# Altium project STM32F4Dash.PrjPcb
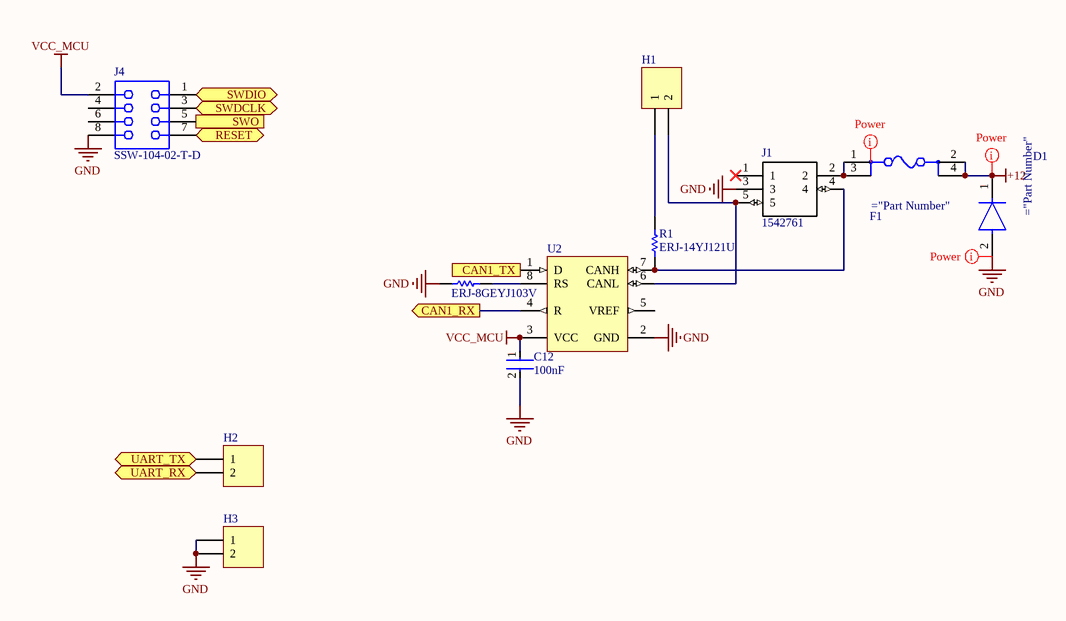
[diagram p0: Communications.SchDoc]
5 sheets, 42 parts. Net scope: flat (ports and power ports of the same name join across sheets).
Board file: STM32F4Dash.PcbDoc
Sheets:
  Communications.SchDoc
  MCU.SchDoc
  IO.SchDoc
  Power_Supply.SchDoc
  User_LEDs.SchDoc

## Sheet Communications.SchDoc
size A; Organization: Altium Limited; Address1: L3, 12a Rodborough Rd; Address2: Frenchs Forest; Address3: NSW; Address4: Australia 2086

### Parts
C12  100nF  [Kemet_C0603_IPC_A]
D1  S1J-13-F  [Diodes_SMA_0]  (value not drawn)
F1  3557-2  [Keystone_3557-2_0]  (value not drawn)
H1  Header 0  [HDR1X2]  (value not drawn)
H2  Header 0  [HDR1X2]  (value not drawn)
H3  Header 0  [HDR1X2]  (value not drawn)
J1  1542761  [1542761]
J4  SSW-104-02-T-D  [SMTC-SSW-104-02-X-D]
R1  ERJ-14YJ121U  [RESC3225X70X50ML20T20]
R9  ERJ-8GEYJ103V  [RESC3216X70X50NL05T20]
U2  SN65HVD230D  [D0008A_M]  (value not drawn)

### Ports
CAN1_RX (out), CAN1_TX (in), RESET (bidir), SWDCLK (bidir), SWDIO (bidir), SWO (out), UART_RX (bidir), UART_TX (bidir)

### Nets
+12: D1.1(C) F1.2 F1.4
GND: C12.2 D1.2(A) H3.1 H3.2 J1.3 J4.8 R9.2 U2.2(GND)
VCC_MCU: C12.1 J4.2 U2.3(VCC)
NetC3_1: J4.7 ; port RESET
NetF1_1: F1.1 F1.3 J1.2
NetH1_1: H1.1 R1.2
NetH1_2: H1.2 J1.5 U2.6(CANL)
NetH2_1: H2.1 ; port UART_TX
NetH2_2: H2.2 ; port UART_RX
NetJ1_4: J1.4 R1.1 U2.7(CANH)
NetJ4_1: J4.1 ; port SWDIO
NetJ4_3: J4.3 ; port SWDCLK
NetJ4_5: J4.5 ; port SWO
NetR9_1: R9.1 U2.8(RS)
NetU1_95: U2.4(R) ; port CAN1_RX
NetU1_96: U2.1(D) ; port CAN1_TX

Not connected (* = marked no-connect by the designer): J1 1*; J4 4 6; U2 5(VREF)

### Layout directives
net class Power: (no net found under the mark), +12, GND

### Notes on the sheet
- Title
- Size:
- Date:
- A
- Number:
- Time:
- Revision:
- Sheet
- of
- File:

### Library data of the parts
C12 = C0603C104K5RACTU: CAP CER 0.1UF 100NF 50V X7R 0603 C0603C104K5RACTU
H1-H3 = Header 2: Header, 2-Pin; LatestRevisionDate: 17-Jul-2002; LatestRevisionNote: Re-released for DXP Platform.; Publisher: Altium Limited
J1 = 1542761: Connector; Manufacturer_Name: Phoenix Contact; Allied_Number: 70170366; Datasheet Link: https://media.digikey.com/PDF/Data%20Sheets/Phoenix%20Contact%20PDFs/1542761.pdf; Height: 18mm; Manufacturer_Part_Number: 1542761; Mouser Part Number: 651-1542761; Mouser Price/Stock: https://www.mouser.com/Search/Refine.aspx?Keyword=651-1542761; RS Part Number: 8025583; RS Price/Stock: http://uk.rs-online.com/web/p/products/8025583; Allied Price/Stock: https://www.alliedelec.com/phoenixcontact-1542761/70170366/
J4 = CMP-1023-00342-1: SQ Post Socket, Through-hole, Vertical, -55 to 105 degC, 2.54mm Pitch, 8-Pin, Female, RoHS; Manufacturer: Samtec; Mounting Technology: Through-hole; ComponentLink3Description: Package Specification; ComponentLink3URL: http://www.samtec.com/documents/webfiles/cpdf/SSW-1XX-XX-XXX-X-XX-XXX-XX-MKT.pdf; Temperature Range: -55 to 105 degC; DatasheetVersion: F-214; PackageVersion: CA, 6/1987; ComponentLink1URL: http://www.samtec.com; RoHS: True; Pitch: 2.54 mm; ComponentLink2Description: Datasheet; ComponentLink2URL: http://www.samtec.com/documents/webfiles/pdf/SSW_TH.PDF; PackageDescription: Assembly, Socket Strip .016 X .031 Tail; PackageReference: SSW-104-02-X-D; ComponentLink1Description: Manufacturer URL; PartNumber: SSW-104-02-T-D; Orientation: Vertical
R1 = CMP-2005-03490-1: 120Ohm; Manufacturer: Panasonic; Part Number: ERJ-14YJ121U
R9 = CMP-2003-00545-1: 10k; Manufacturer: Panasonic; Part Number: ERJ-8GEYJ103V
U2 = CMP-0315-00046-3: CAN Bus Transceiver, 3.3 V, -40 to 85 degC, 8-Pin SOIC (D), Green (RoHS & no Sb/Br), Tube; Supply Voltage Min: 3 V; Supply Voltage Max: 3.6 V; PartNumber: SN65HVD230D; ComponentLink2URL: http://www.ti.com/general/docs/lit/getliterature.tsp?genericGeneric Part Number=SN65HVD230&fileType=pdf; DatasheetVersion: SLOS346N; Generic Part Number: SN65HVD230; Packing: Tube; Temperature Min: -40 degC; Temperature Max: 85 degC; ComponentLink1Description: Manufacturer URL; Mounting Technology: Surface Mount; RoHS: TRUE; ComponentLink1URL: http://www.ti.com/; ComponentLink2Description: Datasheet; PackageDescription: 8-Pin Plastic Small Outline, Body 4.9 x 3.9 mm, Pitch 1.27 mm

## Sheet MCU.SchDoc
size A4; Organization: Altium Limited; Address1: L3, 12a Rodborough Rd; Address2: Frenchs Forest; Address3: NSW; Address4: Australia 2086
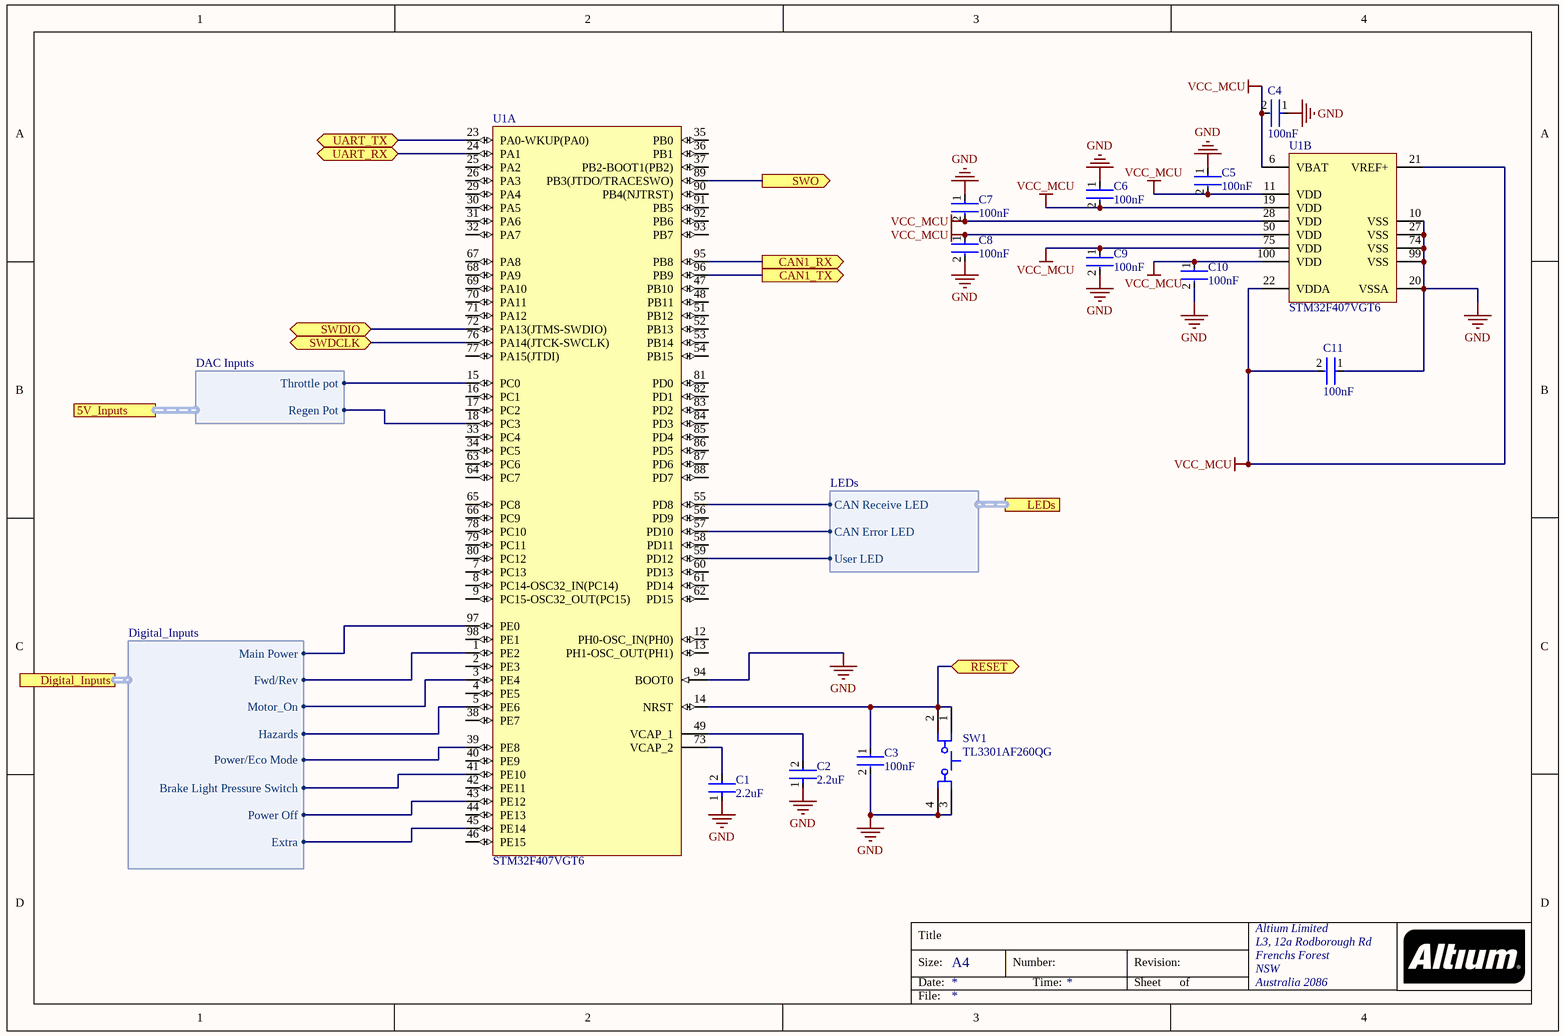
[diagram p1: MCU.SchDoc]

### Parts
C1  2.2uF  [Yageo_CC0805-0.85_IPC_A]
C2  2.2uF  [Yageo_CC0805-0.85_IPC_A]
C3  100nF  [Kemet_C0603_IPC_A]
C4  100nF  [Kemet_C0603_IPC_A]
C5  100nF  [Kemet_C0603_IPC_A]
C6  100nF  [Kemet_C0603_IPC_A]
C7  100nF  [Kemet_C0603_IPC_A]
C8  100nF  [Kemet_C0603_IPC_A]
C9  100nF  [Kemet_C0603_IPC_A]
C10  100nF  [Kemet_C0603_IPC_A]
C11  100nF  [Kemet_C0603_IPC_A]
SW1  TL3301AF260QG  [ESWI-TL3301AF260QG_V]
U1  STM32F407VGT6  [STM-LQFP100_M]  (parts A,B of 2)

### Ports
5V_Inputs (harness DAC Inputs), CAN1_RX (out), CAN1_TX (out), Digital_Inputs (harness Digital_Inputs), LEDs (harness LEDs), RESET (bidir), SWDCLK (bidir), SWDIO (bidir), SWO (out), UART_RX (bidir), UART_TX (bidir)

### Harnesses
DAC Inputs: Throttle pot, Regen Pot
LEDs: CAN Error LED, CAN Receive LED, User LED
Digital_Inputs: Main Power, Fwd/Rev, Motor_On, Hazards, Power/Eco Mode, Brake Light Pressure Switch, Power Off, Extra

### Nets
GND: C1.1 C2.1 C3.2 C4.1 C5.1 C6.1 C7.1 C8.2 C9.2 C10.2 C11.1 SW1.3 SW1.4 U1.10(VSS) U1.20(VSSA) U1.27(VSS) U1.74(VSS) U1.94(BOOT0) U1.99(VSS)
VCC_MCU: C4.2 C5.2 C6.2 C7.2 C8.1 C9.1 C10.1 C11.2 U1.6(VBAT) U1.11(VDD) U1.19(VDD) U1.21(VREF+) U1.22(VDDA) U1.28(VDD) U1.50(VDD) U1.75(VDD) U1.100(VDD)
NetC1_2: C1.2 U1.73(VCAP_2)
NetC2_2: C2.2 U1.49(VCAP_1)
NetC3_1: C3.1 SW1.1 SW1.2 U1.14(NRST) ; port RESET
NetH2_1: U1.23(PA0-WKUP(PA0)) ; port UART_TX
NetH2_2: U1.24(PA1) ; port UART_RX
NetJ2_1: U1.45(PE14) ; port Digital_Inputs.Extra
NetJ2_2: U1.43(PE12) ; port Digital_Inputs.Power Off
NetJ2_3: U1.41(PE10) ; port Digital_Inputs.Brake Light Pressure Switch
NetJ2_4: U1.39(PE8) ; port Digital_Inputs.Power/Eco Mode
NetJ2_5: U1.97(PE0) ; port Digital_Inputs.Main Power
NetJ2_6: U1.1(PE2) ; port Digital_Inputs.Fwd/Rev
NetJ2_7: U1.3(PE4) ; port Digital_Inputs.Motor_On
NetJ2_8: U1.5(PE6) ; port Digital_Inputs.Hazards
NetJ3_2: U1.18(PC3) ; port 5V_Inputs.Regen Pot
NetJ4_1: U1.72(PA13(JTMS-SWDIO)) ; port SWDIO
NetJ4_3: U1.76(PA14(JTCK-SWCLK)) ; port SWDCLK
NetJ4_5: U1.89(PB3(JTDO/TRACESWO)) ; port SWO
NetR2_2: U1.15(PC0) ; port 5V_Inputs.Throttle pot
NetR6_2: U1.55(PD8) ; port LEDs.CAN Receive LED
NetR7_2: U1.57(PD10) ; port LEDs.CAN Error LED
NetR8_2: U1.59(PD12) ; port LEDs.User LED
NetU1_95: U1.95(PB8) ; port CAN1_RX
NetU1_96: U1.96(PB9) ; port CAN1_TX

Not connected (* = marked no-connect by the designer): U1 2(PE3) 4(PE5) 7(PC13) 8(PC14-OSC32_IN(PC14)) 9(PC15-OSC32_OUT(PC15)) 12(PH0-OSC_IN(PH0)) 13(PH1-OSC_OUT(PH1)) 16(PC1) 17(PC2) 25(PA2) 26(PA3) 29(PA4) 30(PA5) 31(PA6) 32(PA7) 33(PC4) 34(PC5) 35(PB0) 36(PB1) 37(PB2-BOOT1(PB2)) 38(PE7) 40(PE9) 42(PE11) 44(PE13) 46(PE15) 47(PB10) 48(PB11) 51(PB12) 52(PB13) 53(PB14) 54(PB15) 56(PD9) 58(PD11) 60(PD13) 61(PD14) 62(PD15) 63(PC6) 64(PC7) 65(PC8) 66(PC9) 67(PA8) 68(PA9) 69(PA10) 70(PA11) 71(PA12) 77(PA15(JTDI)) 78(PC10) 79(PC11) 80(PC12) 81(PD0) 82(PD1) 83(PD2) 84(PD3) 85(PD4) 86(PD5) 87(PD6) 88(PD7) 90(PB4(NJTRST)) 91(PB5) 92(PB6) 93(PB7) 98(PE1)

### Notes on the sheet
- Title
- Size:
- Date:
- A4
- Number:
- Time:
- Revision:
- Sheet
- of
- File:

### Library data of the parts
C1 C2 = CC0805KKX7R6BB225: 2.2UF CC0805KKX7R6BB225
C3-C11 = C0603C104K5RACTU: as C12 on sheet Communications
SW1 = CMP-2000-07249-1: Tactile Switch, SPST-NO, 50 mA, 12 V, -20 to 70 degC, 4-Pin SMD, RoHS, Tape and Reel; Manufacturer: E-Switch; Catalog Drawings: TL3301xFFootprint; Contact Rating @ Voltage: 0.05A@12VDC; Featured Product: TL3301SeriesTactSwitch; Mechanical Life: 100,000Cycles; Product Training Modules: SwitchBasics; Actuator Orientation: TopActuated; Switch Travel: 0.25mm; Other Names: EG2527DKR; 3D Model: TL3301AFyyyyG.stp; Illumination: Non-Illuminated; Switch Function: Off-Mom; Online Catalog: TL3301Series; Outline: 6.00mmx6.00mm; Package Version: Rev. D, 10/2014; Operating Force: 260gf; Actuator Material: Polyamide(PA),Nylon; Actuator Type: Standard; Actuator Height off PCB, from Pins: 5.00mm; Packaging: Digi-Reel®; Standard Package: 1; Datasheet URL: https://www.e-switch.com/system/asset/product_line/data_sheet/185/TL3301.pdf; Family: TactileSwitches; Mounting Technology: SurfaceMount; Illumination Type, Color: -; Manufacturer URL: http://www.e-switch.ch/en/; RoHS Information: TL3301SeriesRoHSCertofCompliance; Ingress Protection: -; Package URL: http://spec_sheets.e-switch.com/specs/P010513.pdf; Illumination Voltage (Nominal): -; Operating Temperature: -20°C~70°C; Series: TL3301; Termination Style: GullWing; Category: Switches; Mounting Type: SurfaceMount; Package Description: 4-Pin Surface Mount Device, Body 6 x 6 mm; Features: -; Circuit: SPST-NO; Package Reference: TL3301AF260QG; Datasheet Version: 12/2013
U1 = CMP-0243-00017-3: ARM Cortex-M4 32-bit MCU+FPU, 210 DMIPS, 1024 kB Flash, 192 kB Internal RAM, 82 I/Os, 100-pin LQFP, -40 to 85 degC, Tray; Manufacturer: STMicroelectronics; Supply Voltage(Vcc) min (V): 1.8; Supply Voltage(Vcc) max (V): 3.6; I/Os (High Current): 82; Operating Frequency(F) (Processor speed) (MHz): 168; D/A Converter: 2x12-bit; FLASH Size (Prog) (kB): 1024; Internal RAM Size (kB): 192; PackageDescription: 100-Pin Low Profile Quad Flat Package, 14 x 14 mm Body, 0.5 mm Pitch; ComponentLink3URL: http://www.st.com/st-web-ui/static/active/en/resource/technical/document/data_brief/DM00071938.pdf; PackageVersion: Rev. 1, 06/2013; PackageReference: LQFP100; PartNumber: STM32F407VGT6; ComponentLink1Description: Manufacturer URL; ComponentLink2URL: http://www.st.com/st-web-ui/static/active/en/resource/technical/document/datasheet/DM00037051.pdf; DatasheetVersion: Rev. 4; ComponentLink3Description: Package Specification; Core: ARM Cortex-M4; ComponentLink2Description: Datasheet; Mounting Technology: Surface Mount; ComponentLink1URL: http://www.st.com/web/en/home.html; Packing: Tray

## Sheet IO.SchDoc
size A; Organization: Altium Limited; Address1: L3, 12a Rodborough Rd; Address2: Frenchs Forest; Address3: NSW; Address4: Australia 2086
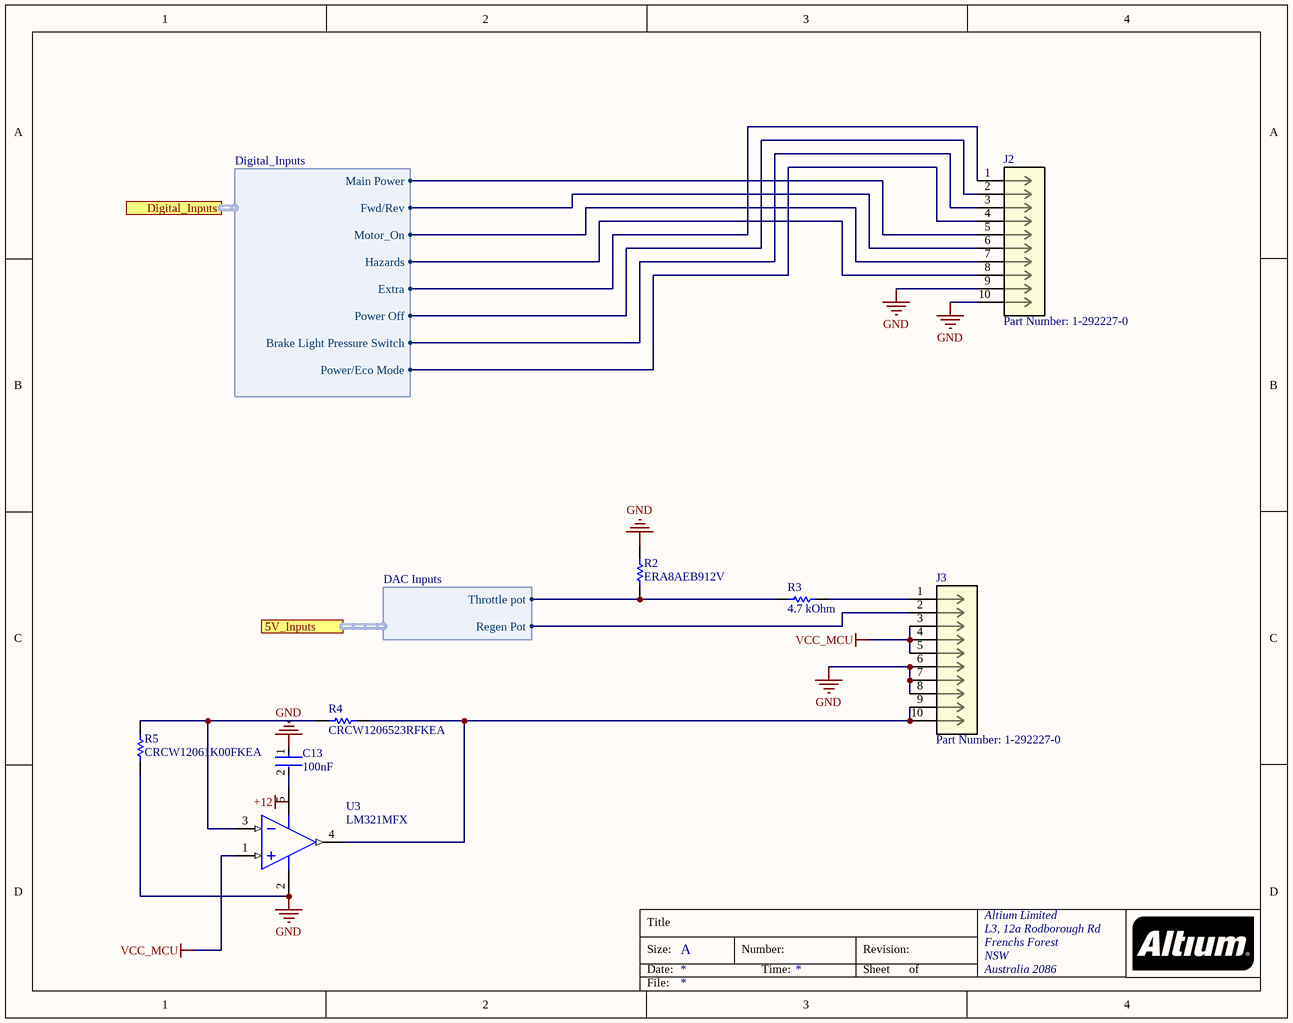
[diagram p2: IO.SchDoc]

### Parts
C13  100nF  [Kemet_C0603_IPC_A]
J2  Part Number: 1-292227-0  [CON10_1X10_DRH_H]
J3  Part Number: 1-292227-0  [CON10_1X10_DRH_H]
R2  ERA8AEB912V  [RESC3216X70X50ML20T25]
R3  4.7 kOhm  [RESC3216X60X45ML15T20]
R4  CRCW1206523RFKEA  [RESC3216X60X45NL10T20]
R5  CRCW12061K00FKEA  [RESC3216X60X45ML15T20]
U3  LM321MFX  [DBV0005A_L]

### Ports
5V_Inputs (harness DAC Inputs), Digital_Inputs (harness Digital_Inputs)

### Harnesses
Digital_Inputs: Main Power, Fwd/Rev, Motor_On, Hazards, Power/Eco Mode, Brake Light Pressure Switch, Power Off, Extra
DAC Inputs: Throttle pot, Regen Pot

### Nets
GND: C13.1 J2.9 J2.10 J3.6 J3.7 J3.8 R2.1 R5.2 U3.2(V-)
VCC_MCU: J3.3 J3.4 J3.5 U3.1(IN+)
NetC13_2: C13.2 U3.5(V+)
NetJ2_1: J2.1 ; port Digital_Inputs.Extra
NetJ2_2: J2.2 ; port Digital_Inputs.Power Off
NetJ2_3: J2.3 ; port Digital_Inputs.Brake Light Pressure Switch
NetJ2_4: J2.4 ; port Digital_Inputs.Power/Eco Mode
NetJ2_5: J2.5 ; port Digital_Inputs.Main Power
NetJ2_6: J2.6 ; port Digital_Inputs.Fwd/Rev
NetJ2_7: J2.7 ; port Digital_Inputs.Motor_On
NetJ2_8: J2.8 ; port Digital_Inputs.Hazards
NetJ3_1: J3.1 R3.1
NetJ3_2: J3.2 ; port 5V_Inputs.Regen Pot
NetJ3_9: J3.9 J3.10 R4.1 U3.4(OUT)
NetR2_2: R2.2 R3.2 ; port 5V_Inputs.Throttle pot
NetR4_2: R4.2 R5.1 U3.3(IN-)

### Notes on the sheet
- Labels drawn without touching a wire or pin: +12
- Title
- Size:
- Date:
- A
- Number:
- Time:
- Revision:
- Sheet
- of
- File:

### Library data of the parts
C13 = C0603C104K5RACTU: as C12 on sheet Communications
J2 J3 = 1-292227-0: No Description Available; Vendor: TE Connectivity; Built_By: EMA_UL_Team; Manufacturer_Part_Number: 1-292227-0; Copyright: Copyright (C) 2018 Accelerated Designs. All rights reserved; RefDes: RefDes; Type: DEV; Value: Value
R2 = CMP-2003-00013-1: Manufacturer: Panasonic; Part Number: ERA8AEB912V
R3 = CMP-2100-03618-1: Chip Resistor, 4.7 KOhm, +/- 1%, 0.25 W, -55 to 155 degC, 1206 (3216 Metric), RoHS, Tape and Reel; Manufacturer: Vishay Semiconductor; Power Rating: 250mW; Voltage Rating: 200V; Temperature Coefficient: 100ppm/degreesC; Package Quantity: 10; Composition: ThickFilm; REACH SVHC: Unknown; Mount: SurfaceMount; Max Operating Temperature: 155degC; Length: 3.2mm; Number of Terminations: 2; Case Code (Metric): 3216; Military Standard: Not; Width: 1.6mm; Datasheet Version: 41061.0; Max Power Dissipation: 250mW; Datasheet URL: http://www.vishay.com/docs/20035/dcrcwe3.pdf; Contact Plating: Tin; Case/Package: 1206; Height: 0.55mm; Package Reference: 1206.0; Lead Free: LeadFree; Weight: 0.000353oz; Package Description: 2-Pin Surface Mount Device, Body 3.15 x 1.6 mm; Min Operating Temperature: -55degC; Resistance: 4.7KOhm; Packaging: TapeandReel; Depth: 1.6mm; Tolerance: 1%; RoHSCompliant: true; Termination: SMD/SMT; Case Code (Imperial): 1206; Voltage Rating (DC): 200V; Radiation Hardening: No; Manufacturer URL: http://www.vishay.com/
R4 = CMP-2003-02266-1: Manufacturer: Vishay Dale; Part Number: CRCW1206523RFKEA
R5 = CMP-2100-03616-1: Chip Resistor, 1 KOhm, +/- 1%, 0.25 W, -55 to 155 degC, 1206 (3216 Metric), RoHS, Tape and Reel; Manufacturer: Vishay Semiconductor; Power Rating: 250mW; Voltage Rating (DC): 200V; Resistance: 1KOhm; Temperature Coefficient: 100ppm/degreesC; Case Code (Imperial): 1206; Length: 3.2mm; Case/Package: 1206; Contact Plating: Tin; Package Quantity: 10; Datasheet URL: http://www.farnell.com/datasheets/1720486.pdf; Mount: SurfaceMount; Package Description: 2-Pin Surface Mount Device, Body 3.15 x 1.6 mm; Package Reference: 1206.0; Max Operating Temperature: 155degC; Lead Free: LeadFree; Weight: 0.000353oz; Military Standard: Not; Max Power Dissipation: 250mW; Case Code (Metric): 3216; Number of Terminations: 2; Tolerance: 1%; Width: 0.063inch; Termination: SMD/SMT; Number of Pins: 2; Min Operating Temperature: -55degC; Height: 0.55mm; Depth: 1.6mm; RoHSCompliant: true; Composition: ThickFilm; Packaging: TapeandReel; Manufacturer URL: http://www.vishay.com/; Voltage Rating: 200V; Radiation Hardening: No; REACH SVHC: Unknown; Datasheet Version: 41061.0
U3 = CMP-0055-01337-3: Low Power Single Op Amp, 5-pin SOT-23; Manufacturer: Texas Instruments; PowerWise: N; CompType: Amplifiers; PackageTopMarking: A63A*XTT; ComponentLink1Description: Datasheet URL; PackageDescription: Molded SOT-23, .115 x .063 x .040 in Body, 5 Lead, .0375 in Pitch; PinCount: 5; ComponentLink1URL: http://www.ti.com/general/docs/lit/getliterature.tsp?genericPartNumber=LM321&fileType=pdf; RoHS: N; Package Reference: DBV0005A

## Sheet Power_Supply.SchDoc
size A; Organization: Altium Limited; Address1: L3, 12a Rodborough Rd; Address2: Frenchs Forest; Address3: NSW; Address4: Australia 2086
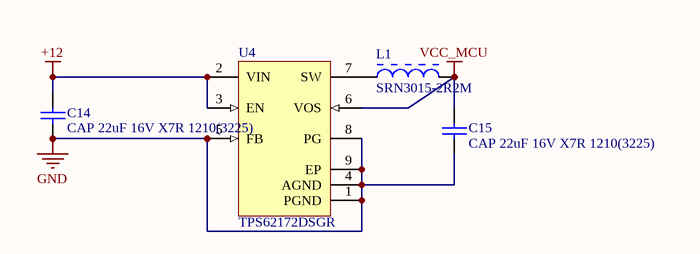
[diagram p3: Power_Supply.SchDoc]

### Parts
C14  CAP 22uF 16V X7R 1210(3225)  [CAPC1210(3225)280_L]
C15  CAP 22uF 16V X7R 1210(3225)  [CAPC1210(3225)280_L]
L1  SRN3015-2R2M  [BOUR-SRN3015-2_V]
U4  TPS62172DSGR  [DSG8-1600X900TP]

### Nets
+12: C14.2 U4.2(VIN) U4.3(EN)
GND: C14.1 C15.1 U4.1(PGND) U4.4(AGND) U4.5(FB) U4.8(PG) U4.9(EP)
VCC_MCU: C15.2 L1.2 U4.6(VOS)
NetL1_1: L1.1 U4.7(SW)

### Notes on the sheet
- Title
- Size:
- Date:
- A
- Number:
- Time:
- Revision:
- Sheet
- of
- File:

### Library data of the parts
C14 C15 = CMP-1038-02277-1: CAP 22uF 16V ±10% 1210 (3225 Metric) Thickness 2.8mm SMD; Case-Metric: 3225; Case-EIA: 1210; Tolerance: Â±10%; Rated Voltage: 16 V; Technology: SMT; Value: 22uF; Max Thickness: 2.8 mm
L1 = CMP-0007-00003-1: Semi-shielded Power Inductor, 2.2 uH, +/- 20%, 1.8 A, -40 to 125 degC, 3 x 3 x 1.5 mm SMD, RoHS and Halogen Free, Tape and Reel; Manufacturer: Bourns; Isat: 1.65 A; Rated current: 1.8 A; Inductance: 2.2 uH; Inductance tolerance: +/- 20%; DCR Max: 0.072 Ohm; SRF Min: 90 MHz; Resistance to Solder Heat: +260 degC for 10 sec.; Operating Temperature: -40 to 125 degC; PartNumber: SRN3015-2R2M; Packing: Tape and Reel; ComponentLink3Description: Package Specification; ComponentLink2Description: Datasheet; RoHS: TRUE; ComponentLink3URL: http://www.bourns.com/data/global/pdfs/SRN3015.pdf; PackageDescription: 2-Pin SMD, Body 3 x 3 mm, Height 1.5 mm; ComponentLink1URL: http://www.bourns.com/; ComponentLink1Description: Manufacturer URL; DatasheetVersion: Aug-11; Mounting Technology: Surface Mount; ComponentLink2URL: http://www.bourns.com/data/global/pdfs/SRN3015.pdf; PackageReference: SRN3015
U4 = TPS62172DSGR: Buck Step Down Regulator with 3 to 17 V Input and 3.3 V Output, -40 to 85 degC, 8-Pin WSON (DSG), Green (RoHS & no Sb/Br); Manufacturer: Texas Instruments; Vout(Min)(V): 3.3; Vin(Min)(V): 3; Duty Cycle(Max)(%): 100; SubFamily: Step-Down Regulator; Iq(Typ)(mA): 0.017; Vin(Max)(V): 17; Synchronous Rectification: TRUE; Regulated Outputs(#): 1; Rating: Catalog; Switch Current Limit(Typ)(A): 1.05; Iout(Max)(A): 0.5; Vout(Max)(V): 3.3; Preset Vout(V): 3.3; Topology: Buck; Eco-Plan: Green (RoHS & no Sb/Br); PartNumber: TPS62172DSGR; ComponentLink1Description: Datasheet; ComponentLink2Description: Package Specification; DatasheetVersion: SLVSAT8A; ComponentLink3URL: Samples URL:http://www.ti.com/product/tps62172#samples; ComponentLink1URL: http://www.ti.com/general/docs/lit/getliterature.tsp?genericPartNumber=TPS62172&fileType=pdf; Code_JEDEC: MO-229; ComponentLink2URL: http://www.ti.com/litv/pdf/mpds308a; ComponentLink3Description: URL Link1; PackageVersion: revB, Oct-2010; Mounting Technology: Surface Mount; PackageReference: DSG8-1600X900TP; PackageDescription: 8-Pin Plastic Small Outline No-Lead, 2 x 2 x 0.8 mm Body, 0.5 mm Pitch, Exposed Pad

## Sheet User_LEDs.SchDoc
size A; Organization: Altium Limited; Address1: L3, 12a Rodborough Rd; Address2: Frenchs Forest; Address3: NSW; Address4: Australia 2086
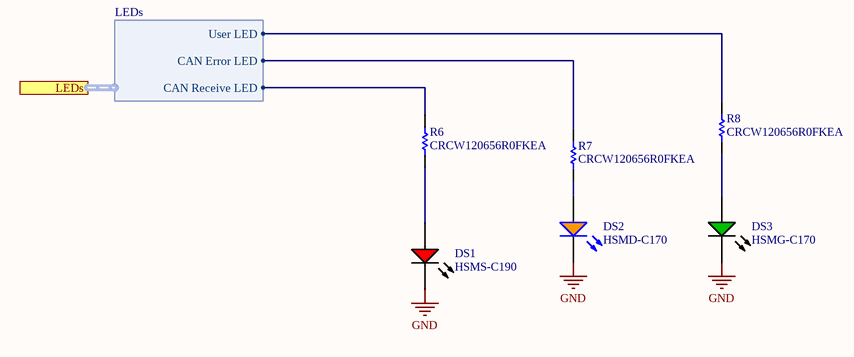
[diagram p4: User_LEDs.SchDoc]

### Parts
DS1  HSMS-C190  [AVAG-HSMX-C190_V]
DS2  HSMD-C170  [AVAG-HSMX-C170_V]
DS3  HSMG-C170  [AVAG-HSMX-C170_V]
R6  CRCW120656R0FKEA  [RESC3216X60X45LL10T20]
R7  CRCW120656R0FKEA  [RESC3216X60X45LL10T20]
R8  CRCW120656R0FKEA  [RESC3216X60X45LL10T20]

### Ports
LEDs (harness LEDs)

### Harnesses
LEDs: CAN Error LED, CAN Receive LED, User LED

### Nets
GND: DS1.2(K) DS2.2(K) DS3.2(K)
NetDS1_1: DS1.1(A) R6.1
NetDS2_1: DS2.1(A) R7.1
NetDS3_1: DS3.1(A) R8.1
NetR6_2: R6.2 ; port LEDs.CAN Receive LED
NetR7_2: R7.2 ; port LEDs.CAN Error LED
NetR8_2: R8.2 ; port LEDs.User LED

### Notes on the sheet
- Title
- Size:
- Date:
- A
- Number:
- Time:
- Revision:
- Sheet
- of
- File:

### Library data of the parts
DS1 = CMP-2000-06427-1: LED Uni-Color Red, 52 mW, 20 mA, -40 to 85 degC, 2-Pin SMD, RoHS, Tape and Reel; Manufacturer: Avago; Reverse Voltage: 5V; Viewing Angle: 170deg; High Brightness: No; Lens Type: ColorlessDiffused; DELETED: Compliant; Product Height (mm): 0.8mm; Dominant Wave Length: 626nm; Number of  Elements: 1; Chip Material: GaP; Lum Intensity: 10mcd; Product Length (mm): 1.6mm; Forward Voltage: 2.6V; Power Dissipation: 52W; Shape Type: Rectangular; Forward Current: 25mA; Peak Wavelength: 630nm; Test Current (It): 20mA; Main Category: ChipLED; Lens Dimensions: 1x0.8x0.5mm; Pin Count: 2; Package Reference: HSMX-C190; Mounting Technology: SurfaceMount; Mounting: SurfaceMount; Datasheet URL: http://docs.avagotech.com/docs/AV02-0551EN; Package Type: ChipLed; Operating Temperature Classification: Industrial; Datasheet Version: 03/2012; Operating Temp Range: -40Cto85C; Emitting Color: Red; Rad Hardened: No; Manufacturer URL: http://www.avagotech.com/; Luminous Intensity: 10mcd; Package Description: 2-Pin Surface Mount Device, Body 1.6 x 0.8 mm, Height 0.9 mm; Type: Uni-Color; Packaging: TapeandReel; Product Depth (mm): 0.8mm
DS2 = CMP-2000-06421-1: LED Uni-Color Orange, 52 mW, 20 mA, -40 to 85 degC, 2-Pin SMD, RoHS, Tape and Reel; Manufacturer: Avago; Forward Current If Max: 20mA; External Length / Height: 2mm; Luminous Intensity: 8mcd; Lens Shape: Rectangular; Bulb Size: 1.25mmx1.4mm; External Width: 1.25mm; Wavelength Typ: 605nm; Dominant Wavelength: 604nm; PIV Max: 5V; Opto Mounting Orientation: Top; Viewing Angle: 170°; LED Type: Standard; Forward Voltage: 2.2V; SVHC: NoSVHC(19-Dec-2012); No. of Pins: 2; External Depth: 0.8mm; Power Dissipation Pd: 52mW; Storage Temperature Max: 85°C; Package Description: 2-Pin Surface Mount Device, Body 2 x 1.25 mm, Height 0.8 mm; MSL: MSL2A-4weeks; Operating Temperature Range: -30°Cto+85°C; Datasheet URL: http://docs.avagotech.com/docs/AV02-0551EN; Manufacturer URL: http://www.avagotech.com/; Operating Temperature Min: -30°C; Light Area Height: 1.25mm; Mounting Technology: SurfaceMount; Storage Temperature Min: -40°C; LED Mounting: SMD; Peak Wavelength: 605nm; Package / Case: SMD; Peak Forward Current: 20mA; Forward Voltage VF Max: 2.2V; Mounting Type: SMD; LED Colour: Orange; Forward Current If: 20mA; Operating Temperature Max: 85°C; Voltage Vf Typ: 2.2V; Package Reference: HSMX-C170; Datasheet Version: 03/2012; Opto Case Style: SMD; Luminous Intensity Typ: 8mcd
DS3 = CMP-2000-05062-1: Chip LED, Green, 2.2 V, -40 to 85 degC, 2-Pin SMD, Pb-Free, Tape and Reel; Manufacturer: Avago; No. of Pins: 2; Peak Wavelength: 570nm; SVHC: NoSVHC(16-Jun-2014); Dominant Wavelength: 572nm; Forward Current If: 20mA; Viewing Angle: 170deg; Lens Shape: Rectangular; PIV Max: 5V; External Width: 1.25mm; LED Type: Standard; External Depth: 0.8mm; Opto Mounting Orientation: Top; Luminous Intensity: 15mcd; Luminous Intensity Min: 4mcd; Forward Voltage VF Max: 2.6V; External Length / Height: 2mm; Bulb Size: 1.25mmx1.4mm; Light Area Height: 1mm; Voltage Vf Typ: 2.2V; Operating Temperature Max: 85degC; Datasheet Version: Oct-08; MSL: MSL2A-4weeks; Peak Forward Current: 20mA; Package Description: 2-Pin Surface Mount Device, Body 2 x 1.25 mm, Height 0.8 mm; Datasheet URL: https://datasheet.ciiva.com/29280/180495-da-01-en-chip-led-hsmg-c170-gelb-gruen-29280971.pdf; Storage Temperature Min: -40degC; LED Colour: Green; Wavelength Typ: 570nm; Mounting Type: SMD; Forward Current If Max: 20mA; Dominant Wavelength Typ: 572nm; LED Mounting: SMD; Operating Temperature Range: -30degCto+85degC; Operating Temperature Min: -30degC; Manufacturer URL: http://www.avagotech.com/; Packaging: CutTape; Luminous Intensity Typ: 15mcd; Package Reference: HSMX-C170; Storage Temperature Max: 85degC; Opto Case Style: SMD; Forward Voltage: 2.2V
R6-R8 = CMP-2003-02285-1: Manufacturer: Vishay Dale; Part Number: CRCW120656R0FKEA

## Nets that join several sheets
+12: Communications (D1.1 F1.2 F1.4), Power_Supply (C14.2 U4.2 U4.3)
GND: Communications (8 pins), MCU (19 pins), IO (9 pins), Power_Supply (7 pins), User_LEDs (DS1.2 DS2.2 DS3.2)
VCC_MCU: Communications (C12.1 J4.2 U2.3), MCU (17 pins), IO (J3.3 J3.4 J3.5 U3.1), Power_Supply (C15.2 L1.2 U4.6)
NetC3_1: Communications (J4.7), MCU (C3.1 SW1.1 SW1.2 U1.14)
NetH2_1: Communications (H2.1), MCU (U1.23)
NetH2_2: Communications (H2.2), MCU (U1.24)
NetJ2_1: MCU (U1.45), IO (J2.1)
NetJ2_2: MCU (U1.43), IO (J2.2)
NetJ2_3: MCU (U1.41), IO (J2.3)
NetJ2_4: MCU (U1.39), IO (J2.4)
NetJ2_5: MCU (U1.97), IO (J2.5)
NetJ2_6: MCU (U1.1), IO (J2.6)
NetJ2_7: MCU (U1.3), IO (J2.7)
NetJ2_8: MCU (U1.5), IO (J2.8)
NetJ3_2: MCU (U1.18), IO (J3.2)
NetJ4_1: Communications (J4.1), MCU (U1.72)
NetJ4_3: Communications (J4.3), MCU (U1.76)
NetJ4_5: Communications (J4.5), MCU (U1.89)
NetR2_2: MCU (U1.15), IO (R2.2 R3.2)
NetR6_2: MCU (U1.55), User_LEDs (R6.2)
NetR7_2: MCU (U1.57), User_LEDs (R7.2)
NetR8_2: MCU (U1.59), User_LEDs (R8.2)
NetU1_95: Communications (U2.4), MCU (U1.95)
NetU1_96: Communications (U2.1), MCU (U1.96)